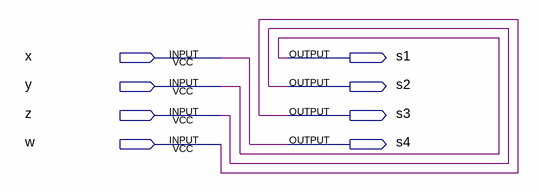
[diagram p0: schematic sheet]
// Quartus schematic rotate3.bdf as structural Verilog: 0 symbols, 8 pins
module rotate3 (
  input  x,
  input  y,
  input  z,
  input  w,
  output s1,
  output s2,
  output s3,
  output s4
);


  assign s1 = y;
  assign s2 = z;
  assign s3 = w;
  assign s4 = x;
endmodule
